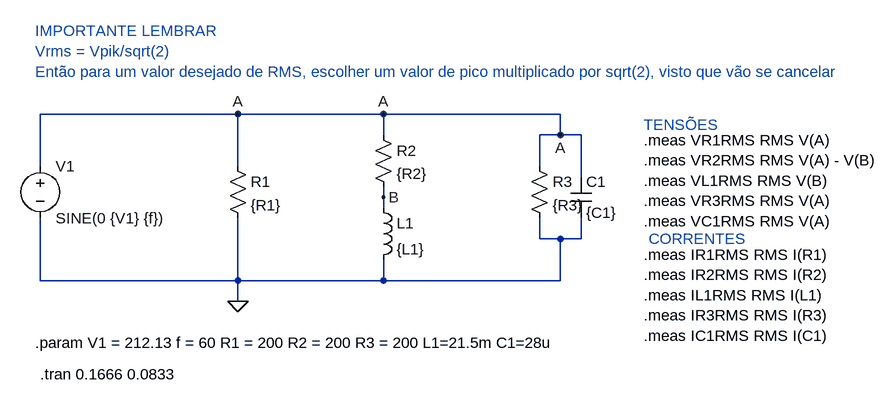
[diagram p0: schematic Lab 01 Bancada a.asc]
Lab 01 Bancada a.asc, the LTspice schematic file:
Version 4.1
SHEET 1 1268 680
WIRE 240 16 -64 16
WIRE 464 16 240 16
WIRE 736 16 464 16
WIRE 464 48 464 16
WIRE 736 48 736 16
WIRE 736 48 704 48
WIRE 768 48 736 48
WIRE -64 96 -64 16
WIRE 240 96 240 16
WIRE 704 96 704 48
WIRE 768 112 768 48
WIRE 464 144 464 128
WIRE 464 160 464 144
WIRE 704 208 704 176
WIRE 736 208 704 208
WIRE 768 208 768 176
WIRE 768 208 736 208
WIRE -64 272 -64 176
WIRE 240 272 240 176
WIRE 240 272 -64 272
WIRE 464 272 464 240
WIRE 464 272 240 272
WIRE 736 272 736 208
WIRE 736 272 464 272
WIRE 240 304 240 272
FLAG 240 304 0
FLAG 240 16 A
FLAG 464 144 B
FLAG 464 16 A
FLAG 736 48 A
SYMBOL voltage -64 80 R0
WINDOW 123 0 0 Left 0
WINDOW 39 0 0 Left 0
SYMATTR InstName V1
SYMATTR Value SINE(0 {V1} {f})
SYMBOL res 224 80 R0
SYMATTR InstName R1
SYMATTR Value {R1}
SYMBOL res 448 32 R0
SYMATTR InstName R2
SYMATTR Value {R2}
SYMBOL ind 448 144 R0
SYMATTR InstName L1
SYMATTR Value {L1}
SYMBOL res 688 80 R0
SYMATTR InstName R3
SYMATTR Value {R3}
SYMBOL cap 752 112 R0
SYMATTR InstName C1
SYMATTR Value {C1}
TEXT -72 368 Left 2 !.param V1 = 212.13 f = 60 R1 = 200 R2 = 200 R3 = 200 L1=21.5m C1=28u
TEXT -72 -112 Left 2 ;IMPORTANTE LEMBRAR\nVrms = Vpik/sqrt(2)\nEntão para um valor desejado de RMS, escolher um valor de pico multiplicado por sqrt(2), visto que vão se cancelar
TEXT -64 416 Left 2 !.tran 0.1666 0.0833
TEXT 864 32 Left 2 ;TENSÕES
TEXT 864 56 Left 2 !.meas VR1RMS RMS V(A)\n.meas VR2RMS RMS V(A) - V(B)\n.meas VL1RMS RMS V(B)\n.meas VR3RMS RMS V(A)\n.meas VC1RMS RMS V(A)
TEXT 872 208 Left 2 ;CORRENTES
TEXT 864 232 Left 2 !.meas IR1RMS RMS I(R1)\n.meas IR2RMS RMS I(R2)\n.meas IL1RMS RMS I(L1)\n.meas IR3RMS RMS I(R3)\n.meas IC1RMS RMS I(C1)

The netlist it stands for:
* Lab 01 Bancada a.asc
V1 A 0 SINE(0 {V1} {f})
R1 A 0 {R1}
R2 A B {R2}
L1 B 0 {L1}
R3 A 0 {R3}
C1 A 0 {C1}
.param V1 = 212.13 f = 60 R1 = 200 R2 = 200 R3 = 200 L1=21.5m C1=28u
* IMPORTANTE LEMBRAR
* Vrms = Vpik/sqrt(2)
* Então para um valor desejado de RMS, escolher um valor de pico multiplicado por sqrt(2), visto que vão se cancelar
.tran 0.1666 0.0833
* TENSÕES
.meas VR1RMS RMS V(A)
.meas VR2RMS RMS V(A) - V(B)
.meas VL1RMS RMS V(B)
.meas VR3RMS RMS V(A)
.meas VC1RMS RMS V(A)
* CORRENTES
.meas IR1RMS RMS I(R1)
.meas IR2RMS RMS I(R2)
.meas IL1RMS RMS I(L1)
.meas IR3RMS RMS I(R3)
.meas IC1RMS RMS I(C1)
.backanno
.end

* Results of the author's LTspice run, read from the files saved beside the schematic
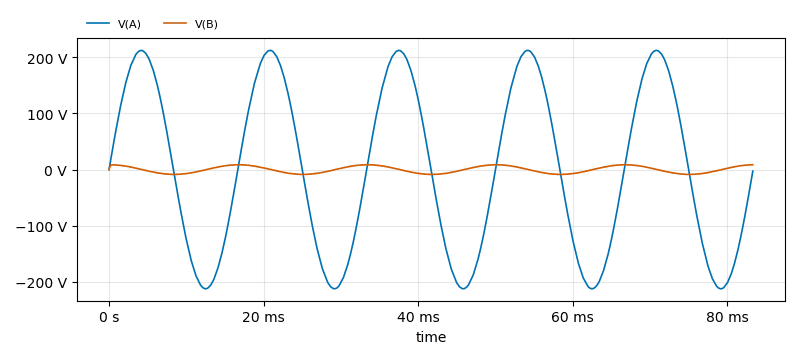
[diagram p1: Transient Analysis of Lab 01 Bancada a.asc, plotted from the saved traces]
* Transient Analysis, 1 run:
*   V(A): min -212.1 V, max 212.1 V, average -4.375 mV, rms 150 V, last -2.666 V
*   V(B): min -8.59 V, max 8.59 V, average -14.79 mV, rms 6.062 V, last 8.578 V
* From the log:
*   vr1rms: RMS(V(A))=150.014206353 FROM 0 TO 0.0833
*   vr2rms: RMS(V(A) - V(B))=149.889928328 FROM 0 TO 0.0833
*   vl1rms: RMS(V(B))=6.0607251 FROM 0 TO 0.0833
*   vr3rms: RMS(V(A))=150.014206353 FROM 0 TO 0.0833
*   vc1rms: RMS(V(A))=150.014206353 FROM 0 TO 0.0833
*   ir1rms: RMS(I(R1))=0.750071030926 FROM 0 TO 0.0833
*   ir2rms: RMS(I(R2))=0.749449644824 FROM 0 TO 0.0833
*   il1rms: RMS(I(L1))=0.749449644824 FROM 0 TO 0.0833
*   ir3rms: RMS(I(R3))=0.750071030926 FROM 0 TO 0.0833
*   ic1rms: RMS(I(C1))=1.58296896377 FROM 0 TO 0.0833